# EAGLE design PolarTableShield (EAGLE 9.2.2)
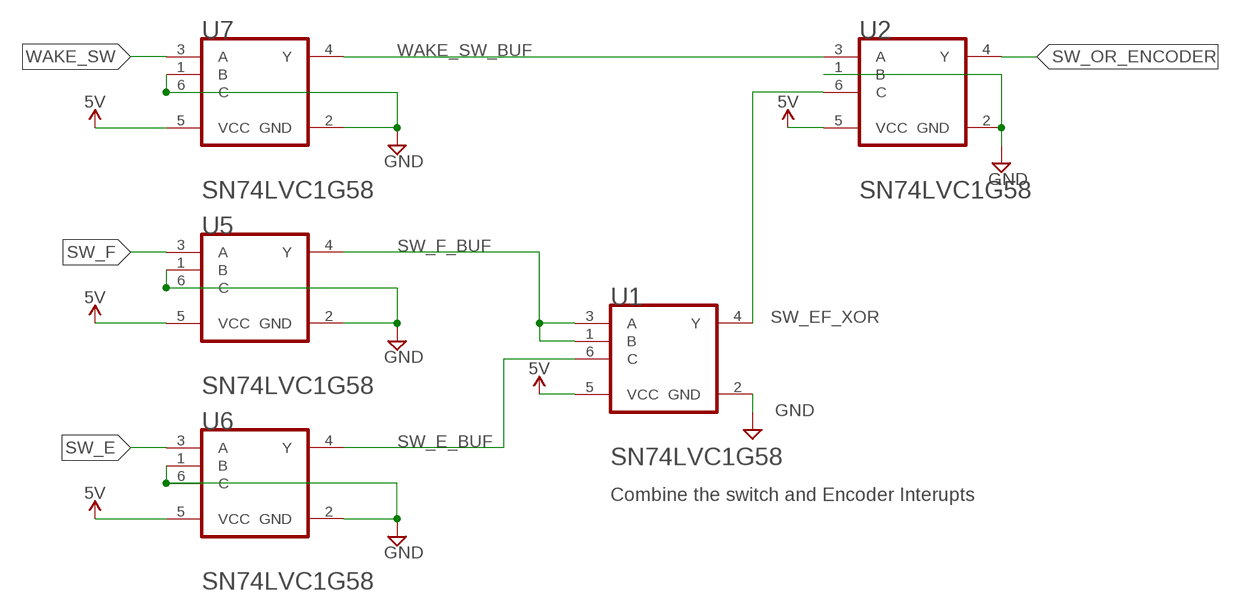
[diagram p0: schematic, sheet 1, part 1 of 2]
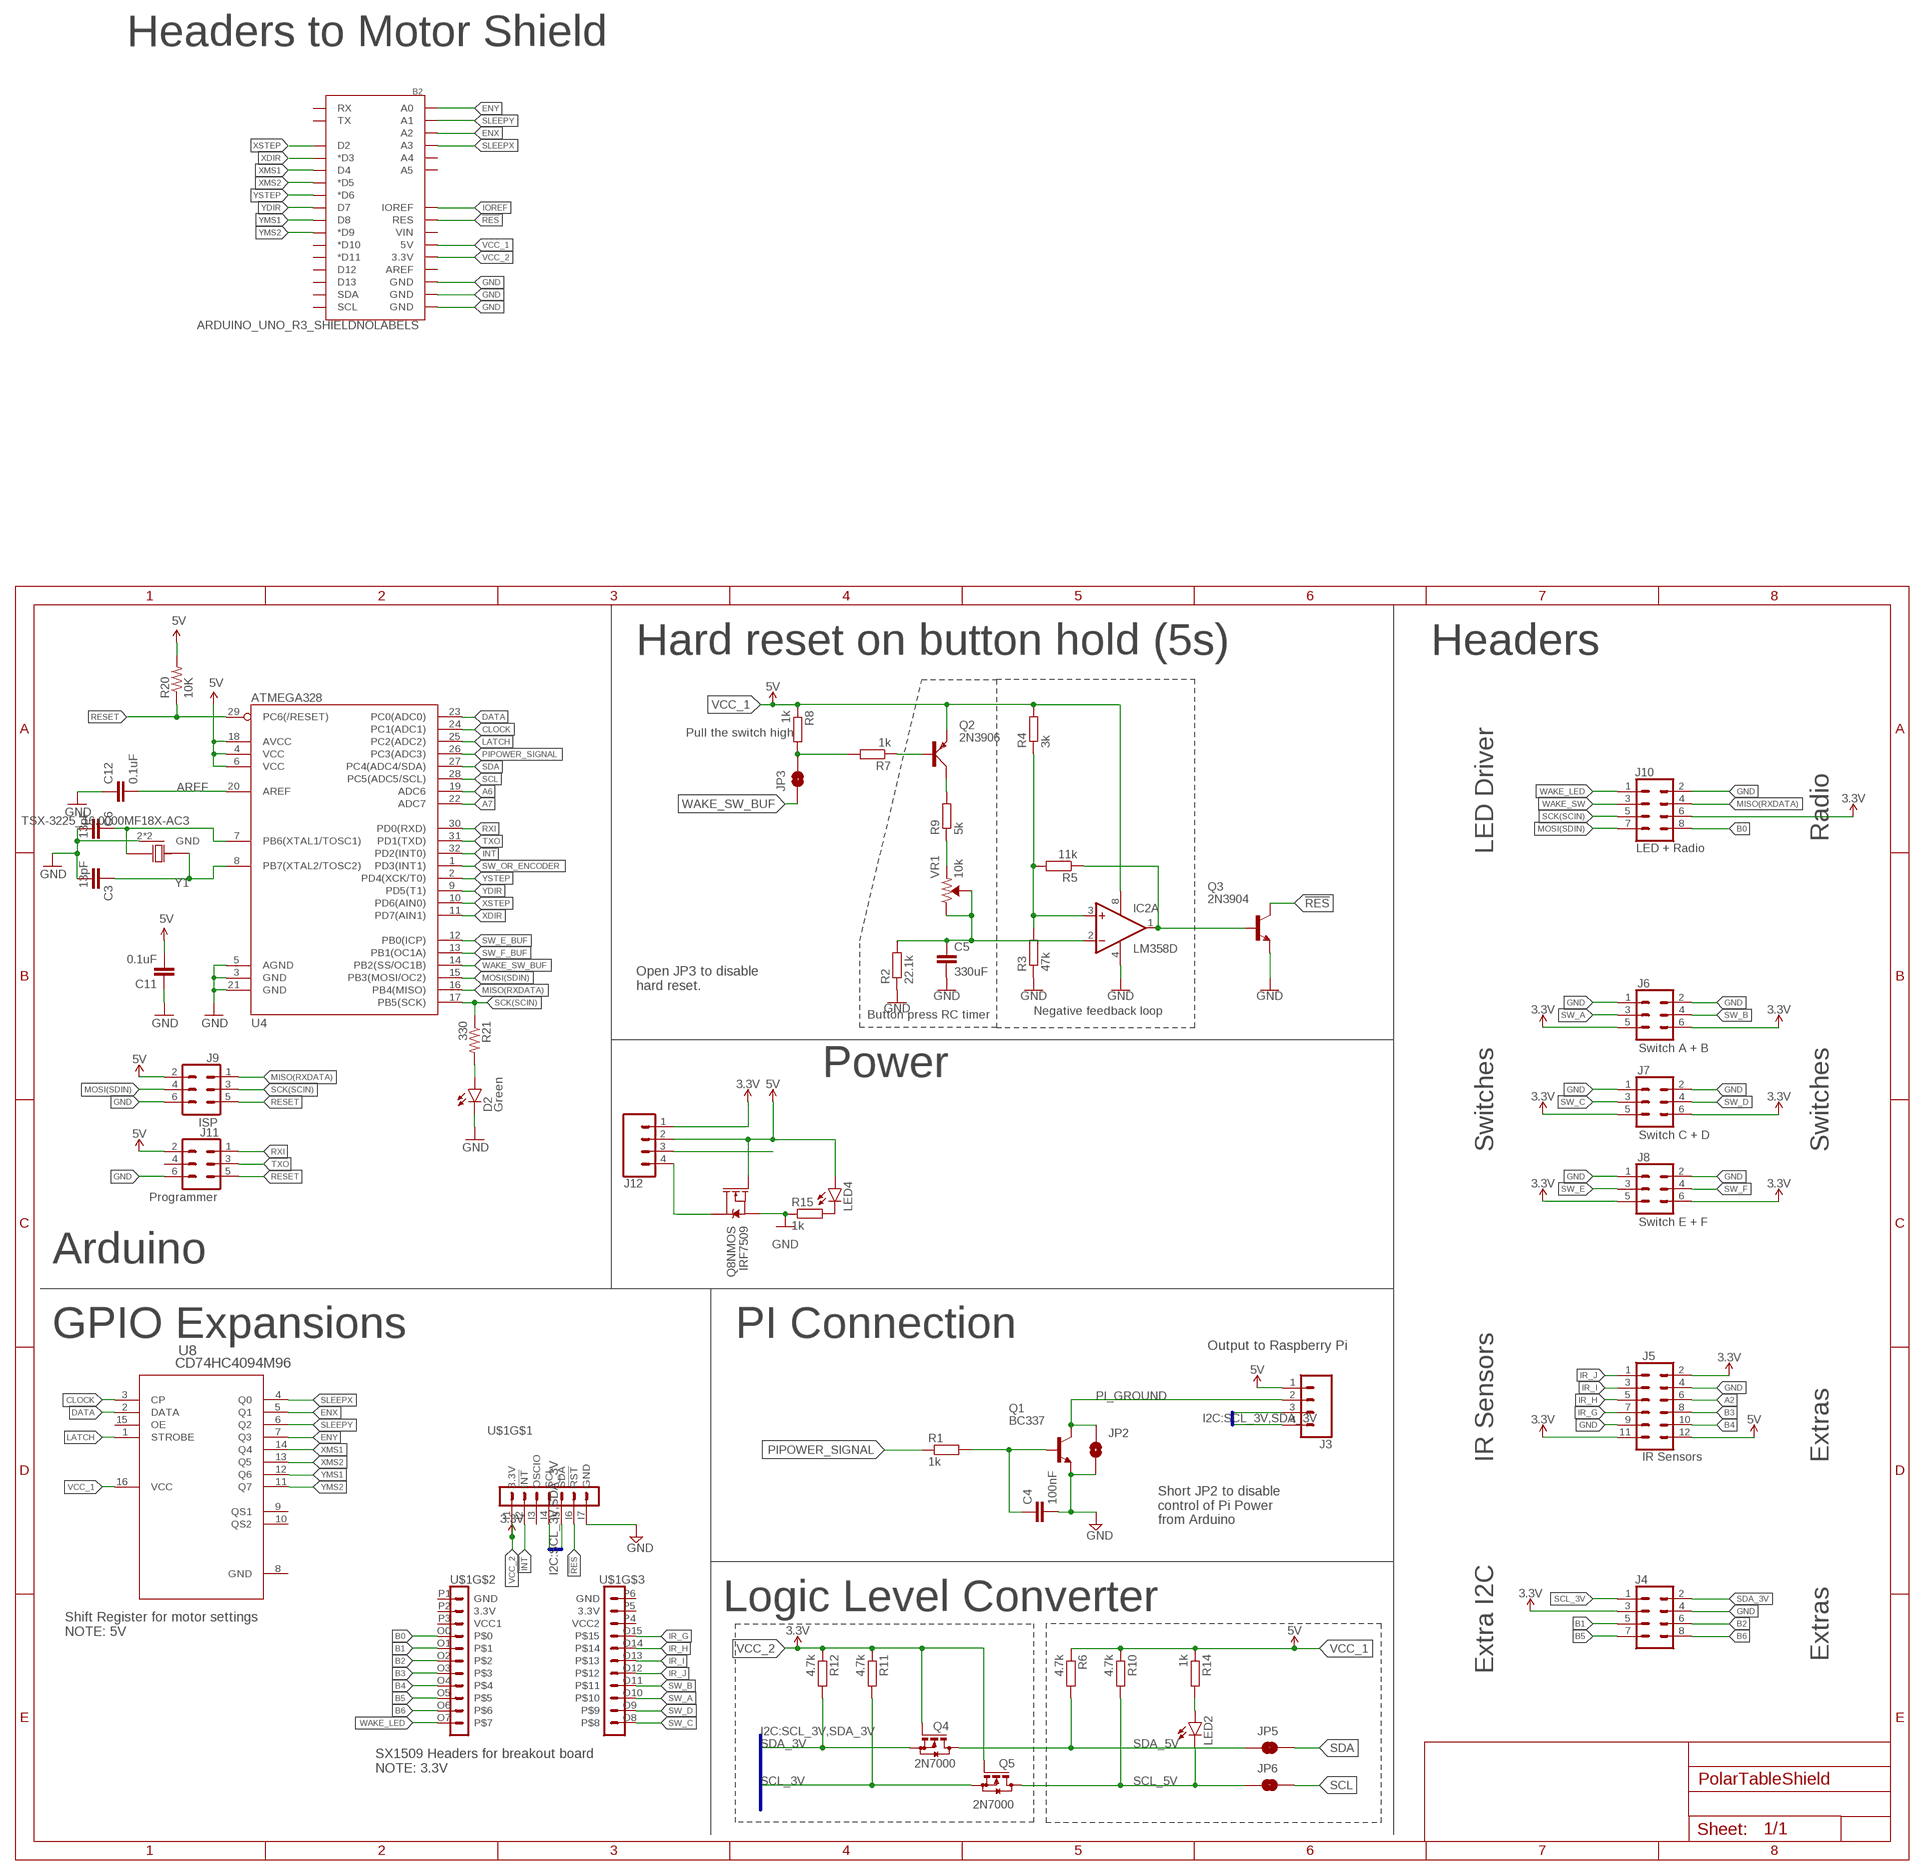
[diagram p1: schematic, sheet 1, part 2 of 2]

## Parts
B2  ARDUINO_UNO_R3_SHIELDNOLABELS  [UNO_R3_SHIELD_NOLABELS]
C3  13pF  CAP0603-CAP  [0603-CAP]
C4  100nF  C-EUC0805  [C0805]
C5  330uF  C-EUC0805  [C0805]
C6  13pF  CAP0603-CAP  [0603-CAP]
C11  0.1uF  CAP0603-CAP  [0603-CAP]
C12  0.1uF  CAP0603-CAP  [0603-CAP]
D2  Green  LEDCHIP-LED0805  [CHIP-LED0805]
IC2  LM358D  [SO08]
J3  Pi Connection  CONN_041X04_1.24MM_RA_MALE  [1X04_1.24MM_RA_MALE]
J4  CONN_04X22X4_1.24MM_RA_MALE  [2X4]
J5  IR Sensors  CONN_06X21.24MM_RA_MALE  [2X6]
J6  Switch A + B  CONN_03X22X03_2.54MM_RA_MALE  [2X3]
J7  Switch C + D  CONN_03X22X03_2.54MM_RA_MALE  [2X3]
J8  Switch E + F  CONN_03X22X03_2.54MM_RA_MALE  [2X3]
J9  ISP  CONN_03X2NO_SILK  [2X3-NS]
J10  LED + Radio  CONN_04X22X4_1.24MM_RA_MALE  [2X4]
J11  Programmer  CONN_03X2NO_SILK  [2X3-NS]
J12  CONN_04JST-PTH  [JST-4-PTH]
JP2  JUMPER-SMT_2_NO_SILK  [SMT-JUMPER_2_NO_SILK]
JP3  Enable Hold to Reset  JUMPER-SMT_2_NC_TRACE_SILK  [SMT-JUMPER_2_NC_TRACE_SILK]
JP5  JUMPER-SMT_2_NC_TRACE_NO-SILK  [SMT-JUMPER_2_NC_TRACE_NO-SILK]
JP6  JUMPER-SMT_2_NC_TRACE_NO-SILK  [SMT-JUMPER_2_NC_TRACE_NO-SILK]
LED2  LEDCHIP-LED0805  [CHIP-LED0805]
LED4  LEDCHIP-LED0805  [CHIP-LED0805]
Q1  BC337  [TO92]
Q2  2N3906  [TO92D]
Q3  2N3904  [TO92]
Q4  2N7000  [TO92-]
Q5  2N7000  [TO92-]
Q8  IRF7509  [MSOP8]
R1  1k  R-EU_M0805  [M0805]
R2  22.1k  R-EU_M0805  [M0805]
R3  47k  R-EU_M0805  [M0805]
R4  3k  R-EU_M0805  [M0805]
R5  11k  R-EU_M0805  [M0805]
R6  4.7k  R-EU_M0805  [M0805]
R7  1k  R-EU_M0805  [M0805]
R8  1k  R-EU_M0805  [M0805]
R9  5k  R-EU_M0805  [M0805]
R10  4.7k  R-EU_M0805  [M0805]
R11  4.7k  R-EU_M0805  [M0805]
R12  4.7k  R-EU_M0805  [M0805]
R14  1k  R-EU_M0805  [M0805]
R15  1k  R-EU_M0805  [M0805]
R20  10K  RESISTOR0603-RES  [0603-RES]
R21  330  RESISTOR0603-RES  [0603-RES]
U1  XOR  TEXAS_INSTRUMENTS_SN74LVC1G58SOT363  [SOT363_PHILIPS]
U2  OR  TEXAS_INSTRUMENTS_SN74LVC1G58SOT363  [SOT363_PHILIPS]
U4  ATMEGA328  ATMEGA168  [TQFP32-08]
U5  Buffer  TEXAS_INSTRUMENTS_SN74LVC1G58SOT363  [SOT363_PHILIPS]
U6  Buffer  TEXAS_INSTRUMENTS_SN74LVC1G58SOT363  [SOT363_PHILIPS]
U7  Buffer  TEXAS_INSTRUMENTS_SN74LVC1G58SOT363  [SOT363_PHILIPS]
U8  CD74HC4094M96  [D16]
U$1  SX1509  [SX1509]
VR1  10k  TRIMPOT-PTH-10MM-KNOB-1/2W-10%  [TRIMPOT-PTH-3386U]
Y1  TSX-3225_16.0000MF18X-AC3  [XTAL_TSX-3225_16.0000MF18X-AC3]

## Nets
12V_SUPPLY [12v_Supply]: J12.3
!INT [3v]: U4.32(PD2(INT0)) U$1.I2(!INT)
!RES [5v]: B2.RES Q3.1(C) U$1.I6(!RST)
$N99 [5v]: JP3.2 R7.2 R8.2
A2 [5v]: J5.6
A6 [5v]: U4.19(ADC6)
A7 [5v]: U4.22(ADC7)
AREF [5v]: C12.2 U4.20(AREF)
B0 [3v]: J10.8 U$1.O0
B1 [3v]: J4.5 U$1.O1
B2 [3v]: J4.6 U$1.O2
B3 [5v]: J5.8 U$1.O3
B4 [5v]: J5.10 U$1.O4
B5 [3v]: J4.7 U$1.O5
B6 [3v]: J4.8 U$1.O6
CLOCK [5v]: U4.24(PC1(ADC1)) U8.3(CP)
COMP_OUT [5v]: IC2.1(A:OUT) Q3.2(B) R5.1
DATA [5v]: U4.23(PC0(ADC0)) U8.2(DATA)
ENX [5v]: B2.A2 U8.5(Q1)
ENY [5v]: B2.A0 U8.7(Q3)
GND [5v]: B2.GND@0(GND) B2.GND@1(GND) B2.GND@2(GND) C3.2 C4.2 C5.2 C6.2 C11.1 C12.1 D2.C IC2.4(P:V-) J4.4 J5.4 J5.9 J6.1 J6.2 J7.1 J7.2 J8.1 J8.2 J9.6 J10.2 J11.6 JP2.2 Q1.1(E) Q3.3(E) Q8.1(NMOS:S) R2.1 R3.1 R15.1 U1.2(GND) U2.1(B) U2.2(GND) U4.3(GND) U4.5(AGND) U4.21(GND) U5.1(B) U5.2(GND) U5.6(C) U6.1(B) U6.2(GND) U6.6(C) U7.1(B) U7.2(GND) U7.6(C) U$1.I7(GND) Y1.2(GND) Y1.4(GND)
IOREF [5v]: B2.IOREF
IR_G [3v]: J5.7 U$1.O15
IR_H [3v]: J5.5 U$1.O14
IR_I [3v]: J5.3 U$1.O13
IR_J [3v]: J5.1 U$1.O12
LATCH [5v]: U4.25(PC2(ADC2)) U8.1(STROBE)
MISO(RXDATA) [5v]: J9.1 J10.4 U4.16(PB4(MISO))
MOSI(SDIN) [5v]: J9.4 J10.7 U4.15(PB3(MOSI/OC2))
N$1 [5v]: Q2.B R7.1
N$2 [5v]: C4.1 Q1.2(B) R1.2
N$3 [5v]: Q2.C R9.2
N$4: J12.4 Q8.7(NMOS:D) Q8.8(NMOS:D)
N$5 [5v]: IC2.3(A:+IN) R3.2 R4.1 R5.2
N$6 [5v]: R9.1 VR1.1(CCW)
N$7 [5v]: C3.1 U4.8(PB7(XTAL2/TOSC2)) Y1.1
N$8 [5v]: C5.1 IC2.2(A:-IN) R2.2 VR1.2(WIPER) VR1.3(CW)
N$9: LED4.C R15.2
N$10 [5v]: LED2.A R14.2
N$14 [5v]: D2.A R21.2
N$16 [5v]: C6.1 U4.7(PB6(XTAL1/TOSC1)) Y1.3
PI_GROUND [5v_Supply]: J3.2 JP2.1 Q1.3(C)
PIPOWER_SIGNAL [5v]: R1.1 U4.26(PC3(ADC3))
RESET [5v]: J9.5 J11.5 R20.1 U4.29(PC6(/RESET))
RXI [5v]: J11.1 U4.30(PD0(RXD))
SCK(SCIN) [5v]: J9.3 J10.5 R21.1 U4.17(PB5(SCK))
SCL [5v]: JP6.2 U4.28(PC5(ADC5/SCL))
SCL_3V [3v]: J3.3 J4.1 Q5.1(S) R11.2 U$1.I4(SCL)
SCL_5V [5v]: JP6.1 LED2.C Q5.3(D) R10.2
SDA [5v]: JP5.2 U4.27(PC4(ADC4/SDA))
SDA_3V [3v]: J3.4 J4.2 Q4.1(S) R12.2 U$1.I5(SDA)
SDA_5V [5v]: JP5.1 Q4.3(D) R6.2
SLEEPX [5v]: B2.A3 U8.4(Q0)
SLEEPY [5v]: B2.A1 U8.6(Q2)
SW_A [3v]: J6.3 U$1.O10
SW_B [3v]: J6.4 U$1.O11
SW_C [3v]: J7.3 U$1.O8
SW_D [3v]: J7.4 U$1.O9
SW_E [5v]: J8.3 U6.3(A)
SW_E_BUF [5v]: U1.6(C) U4.12(PB0(ICP)) U6.4(Y)
SW_EF_XOR [5v]: U1.4(Y) U2.6(C)
SW_F [5v]: J8.4 U5.3(A)
SW_F_BUF [5v]: U1.1(B) U1.3(A) U4.13(PB1(OC1A)) U5.4(Y)
SW_OR_ENCODER [5v]: U2.4(Y) U4.1(PD3(INT1))
TXO [5v]: J11.3 U4.31(PD1(TXD))
VCC_1 [5v]: B2.5V C11.2 IC2.8(P:V+) J3.1 J5.12 J9.2 J11.2 J12.2 LED4.A Q2.E Q8.2(NMOS:G) R4.2 R6.1 R8.1 R10.1 R14.1 R20.2 U1.5(VCC) U2.5(VCC) U4.4(VCC) U4.6(VCC) U4.18(AVCC) U5.5(VCC) U6.5(VCC) U7.5(VCC) U8.16(VCC) ; supply symbol labelled 5V
VCC_2 [3v]: B2.3.3V J4.3 J5.2 J5.11 J6.5 J6.6 J7.5 J7.6 J8.5 J8.6 J10.6 J12.1 Q4.2(G) Q5.2(G) R11.1 R12.1 U$1.I1(3.3V) ; supply symbol labelled 3.3V
WAKE_LED [3v]: J10.1 U$1.O7
WAKE_SW [5v]: J10.3 U7.3(A)
WAKE_SW_BUF [5v]: JP3.1 U2.3(A) U4.14(PB2(SS/OC1B)) U7.4(Y)
XDIR [5v]: B2.D3(*D3) U4.11(PD7(AIN1))
XMS1 [5v]: B2.D4 U8.14(Q4)
XMS2 [5v]: B2.D5(*D5) U8.13(Q5)
XSTEP [5v]: B2.D2 U4.10(PD6(AIN0))
YDIR [5v]: B2.D7 U4.9(PD5(T1))
YMS1 [5v]: B2.D8 U8.12(Q6)
YMS2 [5v]: B2.D9(*D9) U8.11(Q7)
YSTEP [5v]: B2.D6(*D6) U4.2(PD4(XCK/T0))
Unconnected: B2.A4 B2.A5 B2.AREF B2.D10(*D10) B2.D11(*D11) B2.D12 B2.D13 B2.RX B2.SCL B2.SDA B2.TX B2.VIN IC2.5(B:+IN) IC2.6(B:-IN) IC2.7(B:OUT) J11.4 Q8.3(PMOS:S) Q8.4(PMOS:G) Q8.5(PMOS:D) Q8.6(PMOS:D) U8.9(QS1) U8.10(QS2) U8.15(OE) U$1.I3(OSCIO) U$1.P1(GND) U$1.P2(3.3V) U$1.P3(VCC1) U$1.P4(VCC2) U$1.P5(3.3V) U$1.P6(GND)

## Buses
I2C:SCL_3V,SDA_3V

## Notes on the sheet
- Headers to Motor Shield
- Hard reset on button hold (5s) | Headers
- Radio
- LED Driver
- Open JP3 to disable
  hard reset.
- Negative feedback loop
- Button press RC timer
- Power
- Switches | Switches
- Arduino
- GPIO Expansions | PI Connection
- Output to Raspberry Pi
- IR Sensors | Extras
- Short JP2 to disable
  control of Pi Power
  from Arduino
- Logic Level Converter
- Shift Register for motor settings
  NOTE: 5V
- Extras
- Extra I2C
- Combine the switch and Encoder Interupts
- SX1509 Headers for breakout board
  NOTE: 3.3V

## Power pins joined to a net without a drawn wire
GND: U8.8(GND)

## Library data of the parts
B2 = keir_library:ARDUINO_UNO_R3_SHIELD: Arduino R3 Shield Footprint Shield form compatible with the Arduino Uno R3. SparkFun Products: MG2639 Cellular Shield <https://www.sparkfun.com/products/13120> MIDI Shield <https://www.sparkfun.com/products/12898> R3 Stackable Headers Kit <https://www.sparkfun.com/products/11417>
C3 C6 C11 C12 = SparkFun:CAP: Capacitor Standard 0603 ceramic capacitor, and 0.1" leaded capacitor.
C4 C5 = resistor:C-EU: CAPACITOR, European symbol
D2 LED2 LED4 = led:LED: LED OSRAM: - CHIPLED LG R971, LG N971, LY N971, LG Q971, LY Q971, LO R971, LY R971 LH N974, LH R974 LS Q976, LO Q976, LY Q976 LO Q996 - Hyper CHIPLED LW Q18S LB Q993, LB Q99A, LB R99A - SideLED LS A670, LO A670, LY A670, LG A670, LP A670 LB A673, LV A673, LT A673, LW A673 LH A674 LY A675 LS A676, LA A676, LO A676, LY A676, LW A676 LS A679, LY A679, LG A679 - Hyper Micro SIDELED® LS Y876, LA Y876, LO Y876, LY Y876 LT Y87S - SmartLED LW L88C, LW L88S LB L89C, LB L89S, LG L890 LS L89K, LO L89K, LY L89K LS L896, LA L896, LO L896, LY L896 - TOPLED LS T670, LO T670, LY T670, LG T670, LP T670 LSG T670, LSP T670, LSY T670, LOP T670, LYG T670 LG T671, LOG T671, LSG T671 LB T673, LV T673, LT T673, LW T673 LH T674 LS T676, LA T676, LO T676, LY T676, LB T676, LH T676, LSB T676, LW T676 LB T67C, LV T67C, LT T67C, LS T67K, LO T67K, LY T67K, LW E67C LS E67B, LA E67B, LO E67B, LY E67B, LB E67C, LV E67C, LT E67C LW T67C LS T679, LY T679, LG T679 LS T770, LO T770, LY T770, LG T770, LP T770 LB T773, LV T773, LT T773, LW T773 LH T774 LS E675, LA E675, LY E675, LS T675 LS T776, LA T776, LO T776, LY T776, LB T776 LHGB T686 LT T68C, LB T68C - Hyper Mini TOPLED® LB M676 - Mini TOPLED Santana® LG M470 LS M47K, LO M47K, LY M47K Source: http://www.osram.convergy.de LUXEON: - LUMILED® LXK2-PW12-R00, LXK2-PW12-S00, LXK2-PW14-U00, LXK2-PW14-V00 LXK2-PM12-R00, LXK2-PM12-S00, LXK2-PM14-U00 LXK2-PE12-Q00, LXK2-PE12-R00, LXK2-PE12-S00, LXK2-PE14-T00, LXK2-PE14-U00 LXK2-PB12-K00, LXK2-PB12-L00, LXK2-PB12-M00, LXK2-PB14-N00, LXK2-PB14-P00, LXK2-PB14-Q00 LXK2-PR12-L00, LXK2-PR12-M00, LXK2-PR14-Q00, LXK2-PR14-R00 LXK2-PD12-Q00, LXK2-PD12-R00, LXK2-PD12-S00 LXK2-PH12-R00, LXK2-PH12-S00 LXK2-PL12-P00, LXK2-PL12-Q00, LXK2-PL12-R00 Source: www.luxeon.com KINGBRIGHT: KA-3528ASYC Source: www.kingbright.com
IC2 = keir_library:LM358: OP AMP also LM158; LM258; LM2904 Source: http://cache.national.com/ds/LM/LM158.pdf
J3 = keir_library:CONN_04: Multi connection point. Often used as Generic Header-pin footprint for 0.1 inch spaced/style header connections On any of the 0.1 inch spaced packages, you can populate with these: Break Away Headers - Straight <https://www.sparkfun.com/products/116> (PRT-00116) Break Away Male Headers - Right Angle <https://www.sparkfun.com/products/553> (PRT-00553) Female Headers <https://www.sparkfun.com/products/115> (PRT-00115) Break Away Headers - Machine Pin <https://www.sparkfun.com/products/117> (PRT-00117) Break Away Female Headers - Swiss Machine Pin <https://www.sparkfun.com/products/743> (PRT-00743) For SCREWTERMINALS and SPRING TERMINALS visit here: Screw Terimnals on SparkFun.com <https://www.sparkfun.com/search/results?term=Screw+Terminals> (5mm/3.5mm/2.54mm spacing) This device is also useful as a general connection point to wire up your design to another part of your project. Our various solder wires solder well into these plated through hole pads. Hook-Up Wire - Assortment (Stranded, 22 AWG) <https://www.sparkfun.com/products/11375> (PRT-11375) Hook-Up Wire - Assortment (Solid Core, 22 AWG) <https://www.sparkfun.com/products/11367> (PRT-11367) View the entire wire category on our website here <https://www.sparkfun.com/categories/141> Special notes: Molex polarized connector foot print use with SKU : PRT-08231 with associated crimp pins and housings. 1MM SMD Version SKU: PRT-10208
J4 J10 = keir_library:CONN_04X2: Multi connection point. Often used as Generic Header-pin footprint for 0.1 inch spaced/style header connections On any of the 0.1 inch spaced packages, you can populate with these: Break Away Headers - Straight <https://www.sparkfun.com/products/116> (PRT-00116) Break Away Male Headers - Right Angle <https://www.sparkfun.com/products/553> (PRT-00553) Female Headers <https://www.sparkfun.com/products/115> (PRT-00115) Break Away Headers - Machine Pin <https://www.sparkfun.com/products/117> (PRT-00117) Break Away Female Headers - Swiss Machine Pin <https://www.sparkfun.com/products/743> (PRT-00743)
J5 = keir_library:CONN_06X2: Multi connection point. Often used as Generic Header-pin footprint for 0.1 inch spaced/style header connections On any of the 0.1 inch spaced packages, you can populate with these: Break Away Headers - Straight <https://www.sparkfun.com/products/116> (PRT-00116) Break Away Male Headers - Right Angle <https://www.sparkfun.com/products/553> (PRT-00553) Female Headers <https://www.sparkfun.com/products/115> (PRT-00115) Break Away Headers - Machine Pin <https://www.sparkfun.com/products/117> (PRT-00117) Break Away Female Headers - Swiss Machine Pin <https://www.sparkfun.com/products/743> (PRT-00743)
J6-J9 J11 = keir_library:CONN_03X2: Multi connection point. Often used as Generic Header-pin footprint for 0.1 inch spaced/style header connections You can populate with any combo of single row headers, but if you'd like an exact match, check these: Header - 2x3 (Male, 0.1") <https://www.sparkfun.com/products/12807> (PRT-12807) Header - 2x3 (Female, 0.1") <https://www.sparkfun.com/products/13010> (PRT-13010) 2x3 Pin Shrouded Header <https://www.sparkfun.com/products/10877> (PRT-10877) On any of the 0.1 inch spaced packages, you can populate with these: Break Away Headers - Straight <https://www.sparkfun.com/products/116> (PRT-00116) Break Away Male Headers - Right Angle <https://www.sparkfun.com/products/553> (PRT-00553) Female Headers <https://www.sparkfun.com/products/115> (PRT-00115) Break Away Headers - Machine Pin <https://www.sparkfun.com/products/117> (PRT-00117) Break Away Female Headers - Swiss Machine Pin <https://www.sparkfun.com/products/743> (PRT-00743) Special note: the shrouded connector mates well with our 3x2 ribbon cables: Ribbon Crimp Connector - 6-pin (2x3, Female) <https://www.sparkfun.com/products/10651> (PRT-10651) Ribbon Cable - 6 wire (15ft) <https://www.sparkfun.com/products/10646> (PRT-10646)
J12 = SparkFun-Connectors:CONN_04: Multi connection point. Often used as Generic Header-pin footprint for 0.1 inch spaced/style header connections On any of the 0.1 inch spaced packages, you can populate with these: Break Away Headers - Straight <https://www.sparkfun.com/products/116> (PRT-00116) Break Away Male Headers - Right Angle <https://www.sparkfun.com/products/553> (PRT-00553) Female Headers <https://www.sparkfun.com/products/115> (PRT-00115) Break Away Headers - Machine Pin <https://www.sparkfun.com/products/117> (PRT-00117) Break Away Female Headers - Swiss Machine Pin <https://www.sparkfun.com/products/743> (PRT-00743) For SCREWTERMINALS and SPRING TERMINALS visit here: Screw Terimnals on SparkFun.com <https://www.sparkfun.com/search/results?term=Screw+Terminals> (5mm/3.5mm/2.54mm spacing) This device is also useful as a general connection point to wire up your design to another part of your project. Our various solder wires solder well into these plated through hole pads. Hook-Up Wire - Assortment (Stranded, 22 AWG) <https://www.sparkfun.com/products/11375> (PRT-11375) Hook-Up Wire - Assortment (Solid Core, 22 AWG) <https://www.sparkfun.com/products/11367> (PRT-11367) View the entire wire category on our website here <https://www.sparkfun.com/categories/141> Special notes: Molex polarized connector foot print use with SKU : PRT-08231 with associated crimp pins and housings. 1MM SMD Version SKU: PRT-10208; PROD_ID: WIRE-13531; SF_ID: PRT-09916
JP2 = SparkFun-Jumpers:JUMPER-SMT_2_NO: Normally open jumper This jumper has two pads in close proximity to each other. Apply solder to close the connection. Round pads are easier to solder for beginners, but are a lot larger. SparkFun Product that uses the round pads: SparkFun EL Sequencer <https://www.sparkfun.com/products/12781>
JP3 JP5 JP6 = SparkFun-Jumpers:JUMPER-SMT_2_NC_TRACE: Normally closed trace jumper This jumper has a trace between two pads so it's normally closed (NC). Use a razor knife to open the connection. For best results follow the IPC guidelines for cutting traces: Cutout at least 0.063 mm (0.005 in). Remove all loose material to clean up the cut area. Seal the cut with an approved epoxy. Reapply solder to reclose the connection.
Q1 = transistor-npn:BC337*: NPN Transistor
Q2 = transistor-small-signal:2N3906: PNP TRANSISTOR
Q3 = transistor-npn:2N3904: NPN Transistor; NOTE: Pull high until we get comparitor high output
Q4 Q5 = keir_library:2N7000: N-CHANNEL MOS FET
Q8 = SparkFun-DiscreteSemi:IRF7509: Dual N and P Channel MOSFET Dual N/P-Channel 30V 1.25 W 7.8/7.5 nC Hexfet Power Mosfet Surface Mount-MICRO-8. NMOS RDS(ON) 0.11Ω. PMOS RDS(ON) 0.20Ω. Link to datasheet <http://www.irf.com/product-info/datasheets/data/irf7509pbf.pdf> SparkFun Products: SparkFun RedBot Mainboard <https://www.sparkfun.com/products/12097> SparkFun Wake on Shake <https://www.sparkfun.com/products/11447>; PROD_ID: TRANS-07913
R1-R7 R9-R12 R14 R15 = rcl:R-EU_: RESISTOR, European symbol; SPICEPREFIX: R
R8 = rcl:R-EU_: RESISTOR, European symbol; NOTE: Pull the switch high; SPICEPREFIX: R
R20 R21 = SparkFun:RESISTOR: Resistor Basic schematic elements and footprints for 0603, 1206, and PTH resistors.
U1 U2 U5-U7 = Texas Instruments - SN74LVC1G58:TEXAS_INSTRUMENTS_SN74LVC1G58: 74LVC1G58 Low-power configurable multiple function gate Data sheet <https://assets.nexperia.com/documents/data-sheet/74LVC1G58.pdf>
U4 = SparkFun:ATMEGA168
U8 = keir_library:CD74HC4094M96; MANUFACTURER_PART_NUMBER: CD74HC4094M96; VENDOR: Texas Instruments
U$1 = keir_library:SX1509
VR1 = SparkFun-Resistors:TRIMPOT: Trimming Potentiometer (Trimpot) Three-terminal potentiometers, with an adjustable wiper and two adjustable resistors. A pot can be used to create a configurable voltage divider, or as a variable resistor. "Trimpots" are a subset of potentiometers, usually intended for "set-and-forget" applications. They're often more delicate than standard potentiometers - rated for fewer turns. Variants PTH-KNOB - PTH Trimpot w/ finger-adjustable knob Trimpot 10K with Knob <https://www.sparkfun.com/products/9806> (COM-09806) Datasheet <http://www.sparkfun.com/datasheets/Components/General/TSR-3386.pdf> SMD-3MM-CLOSED-FRAME - SMD 3mm Square Closed-Frame Trimpot Used on e.g. EasyDriver - Stepper Motor Driver <https://www.sparkfun.com/products/12779> Datasheet <http://www.bitechnologies.com/pdfs/22.pdf> (22AR10KTR) SMD-5MM - SMD 5mm Square Closed-Frame Trimpot Used on e.g. IOIO-OTG - V2.2 <https://www.sparkfun.com/products/13613> Datasheet <http://www.vishay.com/docs/51008/ts53.pdf> (TS53YL502MR10) SMD-3MM-1/10W-25% - 3mm Square Open-Frame Trimpot Used on e.g. SparkFun Shapeoko <https://www.sparkfun.com/products/13899> Datasheet <http://www.bourns.com/docs/Product-Datasheets/TC33.pdf> (TC33X-2-103E); PROD_ID: RES-09730; SF_SKU: COM-09806
Y1 = keir_library:TSX-3225_16.0000MF18X-AC3: SMD Crystal 16MHz-9pF-10ppm-60R;; AVAILABILITY: Unavailable; DESCRIPTION: SMD Crystal 16MHz-9pF-10ppm-60R;; MF: EPSON; MP: TSX-3225 16.0000MF18X-AC3; PACKAGE: SMD-4 Epson; PRICE: None

## Net classes
1 12v_Supply: width 1.2 mm, clearance 0.31 mm
2 5v_Supply: width 1 mm

## Board
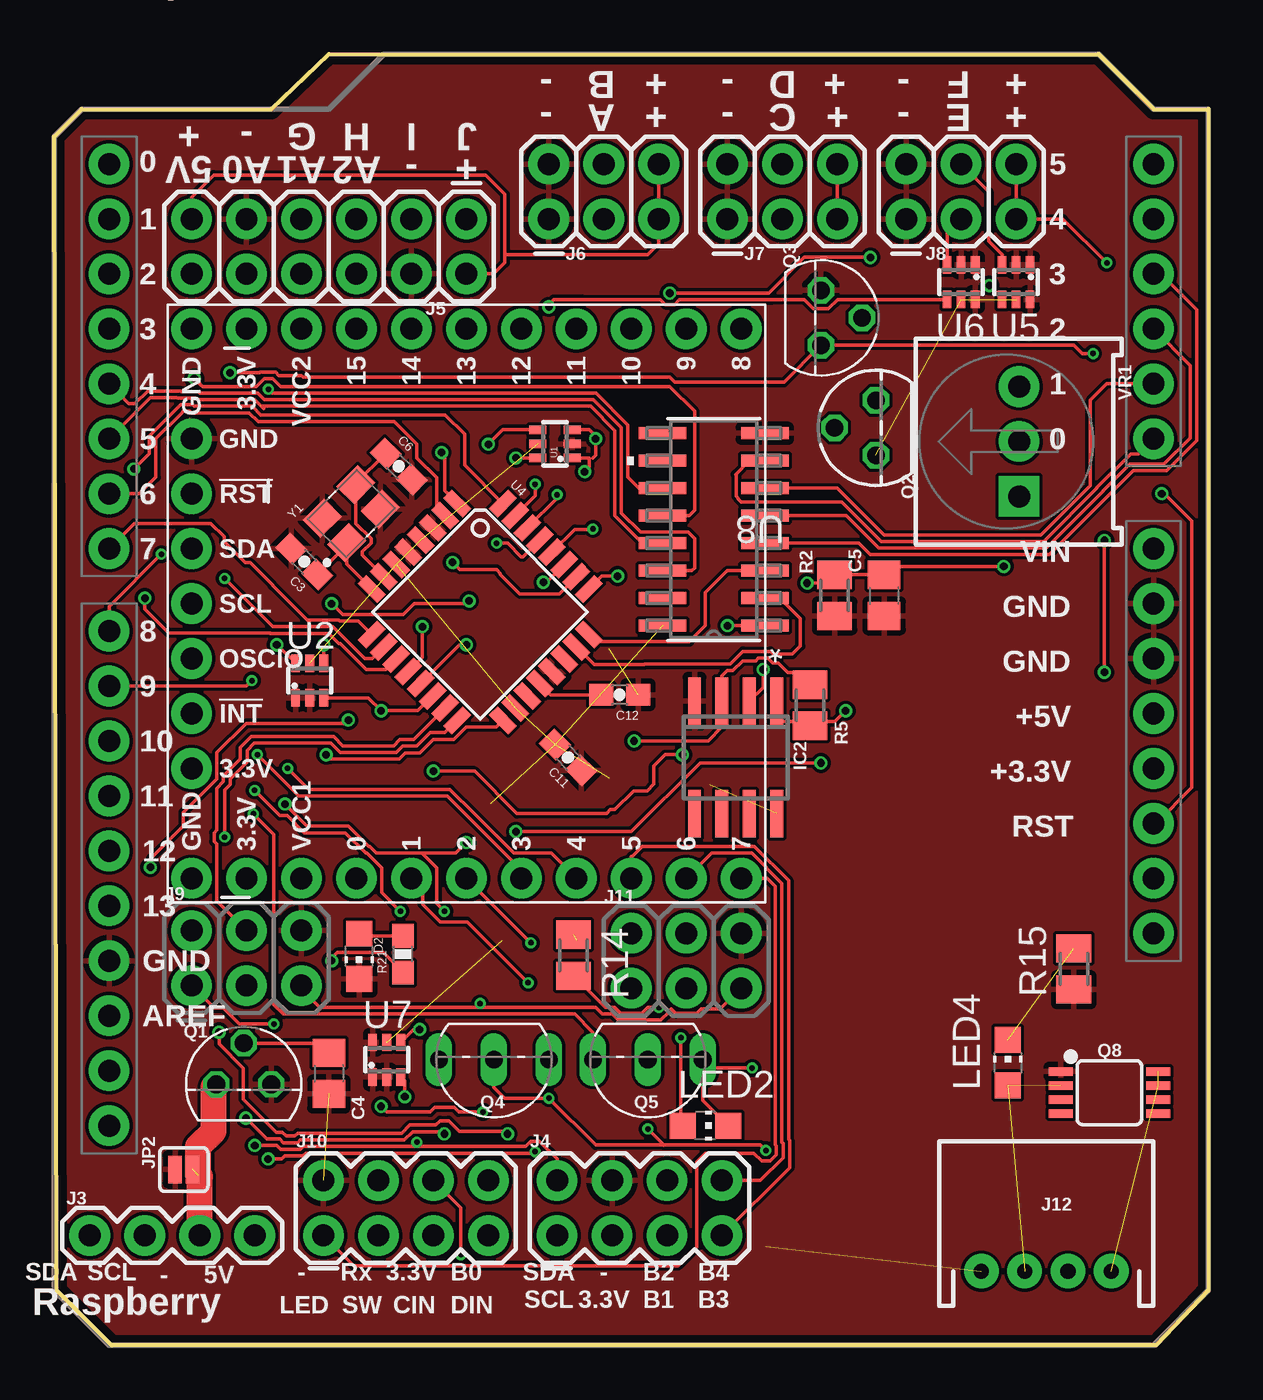
[diagram p2: board, top side]
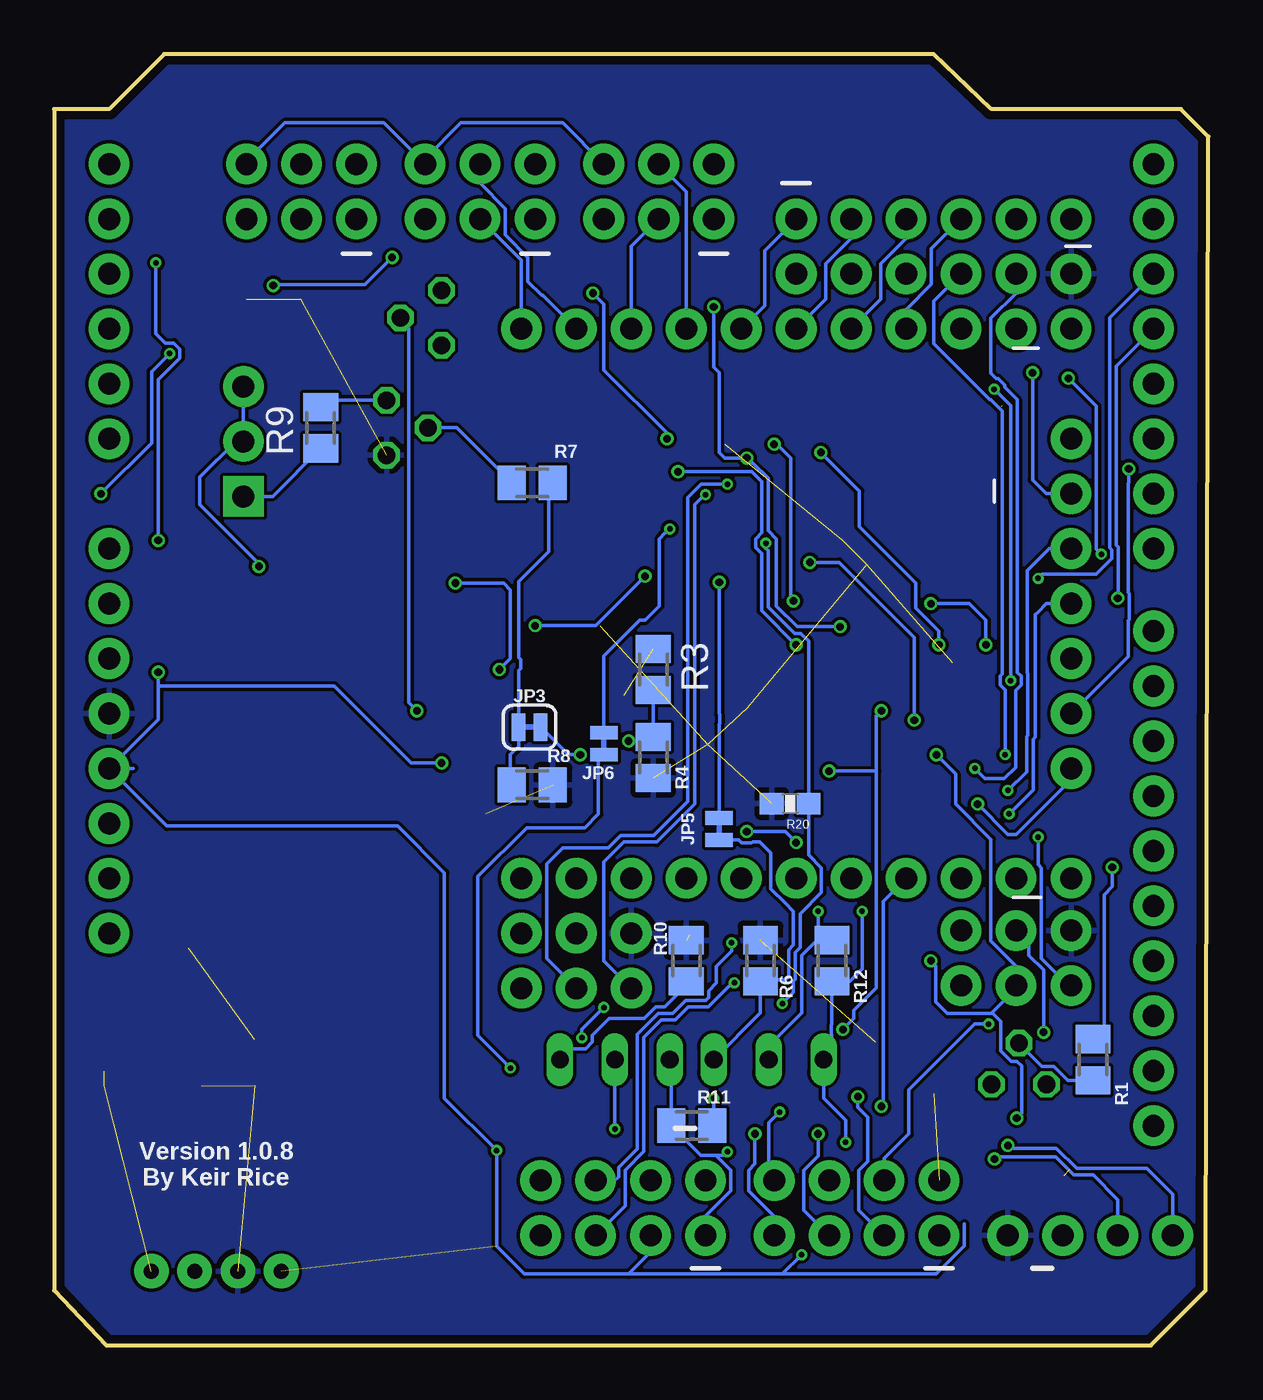
[diagram p3: board, bottom side, seen from below]

Size 53.34 x 59.69 mm. Coordinates in mm from the lower left corner, seen from the top.
Outline: 0.13,2.54 0,55.88 1.27,57.15 10.03,57.15 12.7,59.69 48.26,59.69 50.8,57.15 53.34,57.15 53.34,2.54 50.93,0 2.67,0 0.13,2.54
Copper layers (1*16): Top 0.035559375mm / dielectric 1.6mm / Bottom 0.035559375mm
Design rules "oshpark-2layer": minimum track width 6mil, minimum drill 10mil, track to track 6mil, track to pad 6mil, pad to pad 6mil, via to via 6mil, smd to smd 6mil, copper to edge 15mil, drill to drill 6mil, minimum pad ring 5mil, minimum via ring 5mil, stop-mask expansion 2.5mil, vias tented up to drill 0mil, thermal gap 10mil

### Footprints (pad centres in the part's own frame; a part is rotated, then mirrored left to right if it is on the bottom)
UNO_R3_SHIELD_NOLABELS = drill 1.016 pad 1.88: 3.3V 24.13,-3.81; 5V 24.13,-1.27; A0 24.13,11.43; A1 24.13,13.97; A2 24.13,16.51; A3 24.13,19.05; A4 24.13,21.59; A5 24.13,24.13; AREF -24.13,-15.24; D2 -24.13,19.05; D3 -24.13,16.51; D4 -24.13,13.97; D5 -24.13,11.43; D6 -24.13,8.89; D7 -24.13,6.35; D8 -24.13,2.54; D9 -24.13,0; D10 -24.13,-2.54; D11 -24.13,-5.08; D12 -24.13,-7.62; D13 -24.13,-10.16; GND@0 24.13,1.27; GND@1 24.13,3.81; GND@2 -24.13,-12.7; IOREF 24.13,-8.89; NC 24.13,-11.43; RES 24.13,-6.35; RX -24.13,24.13; SCL -24.13,-20.32; SDA -24.13,-17.78; TX -24.13,21.59; VIN 24.13,6.35
0603-CAP = smd 1.1 x 1: 1 -0.85,0; 2 0.85,0
C0805 = smd 1.3 x 1.5: 1 -0.95,0; 2 0.95,0
CHIP-LED0805 = smd 1.2 x 1.2: A 0,-1.05; C 0,1.05
SO08 = smd 0.6 x 2.2: 1 -1.905,-2.6; 2 -0.635,-2.6; 3 0.635,-2.6; 4 1.905,-2.6; 5 1.905,2.6; 6 0.635,2.6; 7 -0.635,2.6; 8 -1.905,2.6
1X04_1.24MM_RA_MALE = drill 1.016 pad 1.88: 1 0,0; 2 2.54,0; 3 5.08,0; 4 7.62,0
2X4 = drill 1.016 pad 1.88: 1 -3.81,-1.27; 2 -3.81,1.27; 3 -1.27,-1.27; 4 -1.27,1.27; 5 1.27,-1.27; 6 1.27,1.27; 7 3.81,-1.27; 8 3.81,1.27
2X6 = drill 1.016 pad 1.88: 1 0,0; 2 0,2.54; 3 2.54,0; 4 2.54,2.54; 5 5.08,0; 6 5.08,2.54; 7 7.62,0; 8 7.62,2.54; 9 10.16,0; 10 10.16,2.54; 11 12.7,0; 12 12.7,2.54
2X3 = drill 1.016 pad 1.88: 1 0,0; 2 0,2.54; 3 2.54,0; 4 2.54,2.54; 5 5.08,0; 6 5.08,2.54
2X3-NS = drill 1.016 pad 1.88: 1 -2.54,-1.27; 2 -2.54,1.27; 3 0,-1.27; 4 0,1.27; 5 2.54,-1.27; 6 2.54,1.27
JST-4-PTH = drill 0.7 pad 1.6: 1 -3,0; 2 -1,0; 3 1,0; 4 3,0
SMT-JUMPER_2_NO_SILK = smd 0.635 x 1.27: 1 -0.406,0; 2 0.406,0
SMT-JUMPER_2_NC_TRACE_SILK = smd 0.635 x 1.27: 1 -0.508,0; 2 0.508,0
SMT-JUMPER_2_NC_TRACE_NO-SILK = smd 0.635 x 1.27: 1 -0.508,0; 2 0.508,0
TO92 = drill 0.813 octagon: 1 1.27,0; 2 0,1.905; 3 -1.27,0
TO92D = drill 0.813 octagon: B 0,1.905; C 1.27,0; E -1.27,0
TO92- = drill 0.813 long: 1 2.54,0; 2 0,0; 3 -2.54,0
MSOP8 = smd 0.4 x 1.1: 1 -0.975,-2.25; 2 -0.325,-2.25; 3 0.325,-2.25; 4 0.975,-2.25; 5 0.975,2.25; 6 0.325,2.25; 7 -0.325,2.25; 8 -0.975,2.25
M0805 = smd 1.3 x 1.6: 1 -0.95,0; 2 0.95,0
0603-RES = smd 1.1 x 1: 1 -0.85,0; 2 0.85,0
SOT363_PHILIPS = smd 0.4 x 0.8: 1 -0.65,-0.8; 2 0,-0.8; 3 0.65,-0.8; 4 0.65,0.8; 5 0,0.8; 6 -0.65,0.8
TQFP32-08 = smd 1.27 x 0.559: 1 -4.293,2.8; 2 -4.293,2; 3 -4.293,1.2; 4 -4.293,0.4; 5 -4.293,-0.4; 6 -4.293,-1.2; 7 -4.293,-2; 8 -4.293,-2.8; 17 4.293,-2.8; 18 4.293,-2; 19 4.293,-1.2; 20 4.293,-0.4; 21 4.293,0.4; 22 4.293,1.2; 23 4.293,2; 24 4.293,2.8 | smd 0.559 x 1.27: 9 -2.8,-4.293; 10 -2,-4.293; 11 -1.2,-4.293; 12 -0.4,-4.293; 13 0.4,-4.293; 14 1.2,-4.293; 15 2,-4.293; 16 2.8,-4.293; 25 2.8,4.293; 26 2,4.293; 27 1.2,4.293; 28 0.4,4.293; 29 -0.4,4.293; 30 -1.2,4.293; 31 -2,4.293; 32 -2.8,4.293
D16 = smd 2.184 x 0.559: 1 -2.362,4.445; 2 -2.362,3.175; 3 -2.362,1.905; 4 -2.362,0.635; 5 -2.362,-0.635; 6 -2.362,-1.905; 7 -2.362,-3.175; 8 -2.362,-4.445; 9 2.362,-4.445; 10 2.362,-3.175; 11 2.362,-1.905; 12 2.362,-0.635; 13 2.362,0.635; 14 2.362,1.905; 15 2.362,3.175; 16 2.362,4.445
SX1509 = drill 1.016 pad 1.88: I1 -7.62,12.7; I2 -5.08,12.7; I3 -2.54,12.7; I4 0,12.7; I5 2.54,12.7; I6 5.08,12.7; I7 7.62,12.7; O0 -12.7,5.08; O1 -12.7,2.54; O2 -12.7,0; O3 -12.7,-2.54; O4 -12.7,-5.08; O5 -12.7,-7.62; O6 -12.7,-10.16; O7 -12.7,-12.7; O8 12.7,-12.7; O9 12.7,-10.16; O10 12.7,-7.62; O11 12.7,-5.08; O12 12.7,-2.54; O13 12.7,0; O14 12.7,2.54; O15 12.7,5.08; P1 -12.7,12.7; P2 -12.7,10.16; P3 -12.7,7.62; P4 12.7,7.62; P5 12.7,10.16; P6 12.7,12.7
TRIMPOT-PTH-3386U = drill 1.016 pad 1.88 square: 1 -2.54,-0.015 | drill 1.016 pad 1.88: 2 0,-0.015; 3 2.54,-0.015
XTAL_TSX-3225_16.0000MF18X-AC3 = smd 1.4 x 1.15: 1 -1.1,-0.8; 2 1.1,-0.8; 3 1.1,0.8; 4 -1.1,0.8

### Placement (x,y rotation side)
B2  26.67,30.48 0 top
C3  11.56,36.23 135 top
C4  12.7,12.57 270 top
C5  38.35,34.67 270 top
C6  15.93,40.63 315 top
C11  23.75,27.18 135 top
C12  26.14,30.07 180 top
D2  14.1,17.98 180 top
IC2  31.5,27.18 180 top
J3  9.27,5.08 180 top
J4  27.05,6.35 0 top
J5  19.05,52.07 180 top
J6  22.86,52.07 0 top
J7  31.11,52.07 0 top
J8  39.37,52.07 0 top
J9  8.89,17.91 0 top
J10  16.26,6.35 0 top
J11  29.21,17.78 0 top
J12  45.85,3.43 0 top
JP2  5.99,8.13 180 top
JP3  31.37,28.57 180 bottom
JP5  22.61,23.88 90 bottom
JP6  27.94,27.81 90 bottom
LED2  30.1,10.16 270 top
LED4  44.07,13.08 0 top
Q1  8.76,12.06 0 top
Q2  37.97,42.42 90 top
Q3  35.43,47.5 270 top
Q4  20.32,13.21 180 top
Q5  27.43,13.21 180 top
Q8  48.77,11.68 270 top
R1  5.33,13.21 270 bottom
R2  36.07,34.67 90 top
R3  25.65,31.24 270 bottom
R4  25.65,27.18 270 bottom
R5  34.92,29.59 90 top
R6  20.7,17.78 270 bottom
R7  31.24,39.88 0 bottom
R8  31.24,25.91 180 bottom
R9  41.02,42.42 90 bottom
R10  24.13,17.78 270 bottom
R11  23.88,10.16 180 bottom
R12  17.4,17.78 270 bottom
R14  24,18.03 270 top
R15  47.12,17.4 90 top
R20  19.33,25.04 180 bottom
R21  16.13,18.08 90 top
U1  23.14,41.67 90 top
U2  11.81,30.73 0 top
U4  19.68,33.91 315 top
U5  44.45,49.15 180 top
U6  41.91,49.15 180 top
U7  15.37,13.21 0 top
U8  30.48,37.72 180 top
U$1  19.05,34.29 90 top
U$3  [TRI_LOGO_BOTTOM_5MM]  97.28,38.1 0 top  (outside the outline)
VR1  44.58,41.78 90 top
Y1  13.74,38.45 45 top

### Tracks (layer width: path | path; a pad name or v marks a point on that pad's centre or on a via)
!INT  (via drill 0.35)
  Top 0.152: U4.32 18.97,40.69 18.97,42.11 18.08,43 9.55,43 9.15,43.41 6.48,43.41 6.4,43.48 5.84,43.48 4.39,42.04 4.39,41.22 v3.68,40.51
  Bottom 0.152: v3.68,40.51 3.68,39.88 3.71,39.85 3.71,34.81 3.66,34.76 3.66,33.55 3.71,33.5 3.71,31.85 U$1.I2
!RES  (via drill 0.25, 0.35)
  Top 0.152: v48.01,45.85 47.5,45.85 47.12,46.23 Q3.1 33.73,44.53 28.68,44.53 28.45,44.76 11.51,44.76 11.43,44.83 10.38,44.83 10.23,44.98 9.53,44.98 9.5,44.96 v8.13,44.96 | B2.RES 50.93,24.13 52.58,25.78 52.58,38.1 51.31,39.37 v51.18,39.37
  Bottom 0.152: U$1.I6 7.49,39.37 8.13,40.01 v8.13,44.96 | v48.01,45.85 48.83,45.02 48.83,41.72 v51.18,39.37
$N99
  Bottom 0.152: R7.2 30.48,39.69 30.48,36.7 31.88,35.31 31.88,31.8 31.77,31.7 31.77,31.3 31.88,31.2 JP3.2 31.88,27.69 32.26,27.3 32.26,25.97 R8.2
AREF
  Top 0.152: C12.2 22.95,30.07 U4.20
B0  (via drill 0.25, 0.35)
  Top 0.152: v19.81,10.79 18.69,10.79 18.49,11 17.58,11 17.38,10.79 15.37,10.79 v15.11,11.05
  Bottom 0.152: J10.8 20.32,7.87 20.32,10.29 v19.81,10.79 | U$1.O0 15.04,20.52 15.04,15.02 15.03,15.01 15.03,11.13 v15.11,11.05
B1  (via drill 0.25)
  Top 0.152: U$1.O1 17.03,21.07 17.03,20.39 17.83,19.58 19.09,19.58 v21.91,16.76
  Bottom 0.152: J4.5 26.95,6.45 26.95,8.1 26.09,8.97 26.09,14.24 25.29,15.04 24.64,15.04 24.03,15.65 23.11,15.65 22.25,16.5 22.25,16.51 22,16.76 v21.91,16.76
B2  (via drill 0.25)
  Top 0.152: U$1.O2 v22.04,18.61
  Bottom 0.152: v22.04,18.61 22.04,18.22 22.73,17.53 22.73,16.76 23.1,16.4 23.1,16.09 23.23,15.95 24.15,15.95 24.76,15.34 25.42,15.34 26.39,14.37 26.39,9.09 27.25,8.23 27.25,7.8 27.43,7.62 J4.6
B3  (via drill 0.25)
  Top 0.152: v9.4,27.3 11.3,25.4 18.16,25.4 21.59,21.97 U$1.O3
  Bottom 0.152: J5.8 12.7,48.26 12.7,46.31 10.11,43.71 10.06,43.71 9.53,43.18 9.53,31.04 9.63,30.93 9.63,30.53 9.4,30.3 v9.4,27.3
B4  (via drill 0.25)
  Top 0.152: v10.79,26.67 11.76,25.71 18.28,25.71 19.43,24.56 21.23,22.76 22.96,22.76 U$1.O4
  Bottom 0.152: J5.10 8.89,48.64 10.06,47.47 10.06,44.94 9.8,44.68 9.71,44.68 9.42,44.4 9.42,44.3 8.84,43.72 8.84,31.11 8.66,30.93 8.66,30.53 8.91,30.28 8.91,26.72 9.44,26.2 10.33,26.2 v10.79,26.67
B5
  Top 0.152: U$1.O5 26.67,22.61 26.72,22.61 27.18,23.06 32.36,23.06 33.93,21.49 33.93,9.52 33.98,9.47 33.98,8.2 J4.7
B6
  Top 0.152: J4.8 32.64,7.62 33.68,8.66 33.68,9.34 33.63,9.39 33.63,21.36 32.23,22.76 30.38,22.76 U$1.O6
CLOCK
  Top 0.152: U8.3 31.11,35.81 30.1,34.8 30.1,33.27 29.36,32.53 25.02,32.53 U4.24
COMP_OUT  (via drill 0.35)
  Top 0.152: IC2.1 33.4,28.83 34.74,28.83 R5.1 35.11,28.83 35.94,28.83 36.07,28.83 v36.58,29.34
  Bottom 0.152: Q3.2 37.4,47.43 36.96,46.99 36.96,29.72 v36.58,29.34
DATA
  Top 0.152: U4.23 24.95,31.47 27.27,31.47 27.29,31.5 31.24,31.5 31.82,32.08 33.11,32.08 33.24,31.95 34.11,31.95 34.48,32.32 34.48,33.59 33.53,34.54 U8.2
ENX
  Top 0.152: B2.A2 52.49,45.3 52.49,41.95 51.28,40.74 49.71,40.74 48.49,39.52 48.49,39.5 45.85,36.85 38.1,36.85 36.6,38.35 U8.5
ENY
  Top 0.152: B2.A0 50.09,41.2 49.74,41.2 48.18,39.65 48.18,39.62 45.72,37.16 38.23,37.16 36.4,38.99 31.75,38.99 31.62,39.12 31.62,39.15 31.52,39.25 31.52,40.23 31.5,40.26 32.13,40.89 U8.7
GND  (2 unrouted)
  pour Top: 0.13,55.88 1.4,57.15 10.16,57.15 12.7,59.69 48.26,59.69 50.8,57.15 53.34,57.15 53.34,2.54 50.8,0 2.67,0 0.13,2.54
IR_G
  Bottom 0.152: U$1.O15 13.97,47.88 12.8,49.05 12.8,50.7 J5.7
IR_H
  Bottom 0.152: J5.5 13.97,51.18 15.14,50.01 15.14,48.36 U$1.O14
IR_I
  Bottom 0.152: J5.3 16.51,51.18 17.68,50.01 17.68,48.36 U$1.O13
IR_J
  Bottom 0.152: J5.1 20.51,50.61 20.51,48.07 U$1.O12
LATCH  (via drill 0.35)
  Top 0.152: U4.25 25.3,35.56 v26.04,35.56 | v31.11,33.27 U8.1
  Bottom 0.152: v26.04,35.56 28.32,33.27 v31.11,33.27
MISO(RXDATA)  (via drill 0.25)
  Top 0.152: J9.1 7.39,15.6 7.82,15.6 8.56,14.86 v10.16,14.86 | U4.16 18.06,28.32 17.39,28.32 16.77,27.7 16.11,27.7 15.81,27.41 13.22,27.41 12.79,27.84 9.25,27.84 8.91,27.5 8.91,26.98 8.13,26.19 8.13,25.93 7.87,25.68 v7.87,23.5
  Bottom 0.152: v7.87,23.5 7.87,22.23 7.72,22.07 7.72,17.88 6.48,16.64 J9.1 | v10.16,14.86 10.79,14.86 13.84,11.81 13.84,9.78 14.99,8.64 J10.4
MOSI(SDIN)  (via drill 0.35)
  Top 0.152: v7.62,14.48 7.62,13.93 8.74,12.81 8.74,11.37 10.26,9.85 10.55,9.85 10.72,9.68 11.12,9.68 11.25,9.8 16.06,9.8 16.44,10.19 17.63,10.19 17.83,10.39 18.23,10.39 18.72,9.91 20.83,9.91 v20.95,9.78 | J9.4 7.52,20.55 7.52,23.17 7.39,23.3 7.39,23.7 7.52,23.82 7.52,25.75 7.82,26.06 7.82,26.32 8.61,27.1 8.61,27.63 9.12,28.14 12.92,28.14 13.35,27.71 15.69,27.71 15.98,28 16.61,28 U4.15
  Bottom 0.152: J10.7 20.07,5.97 21.23,7.14 21.23,8.1 20.95,8.38 v20.95,9.78 | J9.4 8.31,18.59 8.31,18.04 7.62,17.35 v7.62,14.48
N$1
  Bottom 0.152: R7.1 34.73,42.42 Q2.B
N$2
  Top 0.152: C4.1 12.25,13.97 Q1.2
  Bottom 0.152: 8.7,13.9 Q1.2 7.7,12.9 7.15,12.9 6.5,12.26 R1.2
N$3
  Bottom 0.152: Q2.C 40.7,43.69 R9.2
N$4  (2 unrouted)
N$5  (via drill 0.35)
  Top 0.152: R5.2 34.36,31.11 33.91,31.11 33.46,31.55 33.2,31.55 32.99,31.77 32.55,31.77 32.42,31.65 31.82,31.65 31.37,31.19 31.11,31.19 30.86,30.94 IC2.3 30.86,28.57 30.23,27.94 v26.8,27.94
  Bottom 0.152: R4.1 R3.2 | 25.59,28.13 R4.1 | v26.8,27.94 25.84,27.94 R4.1
N$6
  Bottom 0.152: R9.1 43.25,39.24 VR1.1
N$7
  Top 0.152: C3.1 13.52,37 Y1.1 13.52,36.11 U4.8
N$8  (via drill 0.35)
  Top 0.152: v32.77,31.24 32.77,30.41 IC2.2 | v34.8,35.24 35.69,35.24 R2.2 C5.1 38.74,36.01 v43.88,36.01
  Bottom 0.152: VR1.3 VR1.2 44.96,41.78 46.61,40.13 46.61,38.86 43.88,36.13 v43.88,36.01 | v32.77,31.24 32.26,31.75 32.26,34.92 32.57,35.24 v34.8,35.24
N$9  (1 unrouted)
N$10  (via drill 0.25)
  Top 0.152: LED2.A 28.96,10.16 v28.96,14.22 | R14.2 25.47,15.62 25.91,15.62 26.19,15.34 27.15,15.34 27.43,15.62 v27.94,15.62
  Bottom 0.152: v27.94,15.62 28.96,14.61 v28.96,14.22
N$14
  Top 0.152: R21.2 14.2,18.93 D2.A
N$16
  Top 0.152: C6.1 13.95,39.85 Y1.3 13.95,37.99 14.65,37.29 14.65,37.1 14.24,36.69 14.24,36.52 U4.7
PI_GROUND  (1 unrouted)
  Top 1.2: Q1.3 7.37,11.94 7.37,9.91 6.66,9.2 6.66,7.87 6.73,7.8 J3.2
PIPOWER_SIGNAL  (via drill 0.35)
  Top 0.152: U4.26 23.35,34.74 21.52,34.74 20.62,35.64 20.62,35.69 20.45,35.87 18.75,35.87 v18.41,36.2 | v13.6,28.9 13.44,28.75 8.87,28.75 7.52,27.4 7.52,26.19 5.97,24.64 5.97,24 4.45,22.48 v4.45,22.1
  Bottom 0.152: R1.1 4.83,14.67 4.83,20.83 4.45,21.21 v4.45,22.1 | v13.6,28.9 13.6,32.72 17.07,36.2 v18.41,36.2
RESET  (via drill 0.25)
  Top 0.152: J11.5 30.79,15.54 29.9,15.54 29.69,15.34 28.73,15.34 28.52,15.54 28.42,15.45 28.42,15.42 28.04,15.04 26.06,15.04 25.78,15.32 25.34,15.32 25.03,15.63 19.86,15.63 | J9.5 11.43,16.48 12.28,15.63 19.86,15.63 | 19.86,15.63 v19.68,15.8 | U4.29 21.66,36.45 21.59,36.45 20.95,37.08 v20.45,37.08
  Bottom 0.152: v19.68,15.8 19.18,16.31 19.18,16.84 19.1,16.92 19.1,18.16 18.87,18.39 18.87,19.94 17.88,20.93 17.88,22.07 18.48,22.67 R20.1 18.48,32.56 18.83,32.92 19.12,32.92 20.35,34.14 20.35,36.73 20.45,36.83 v20.45,37.08
RXI  (via drill 0.25)
  Top 0.152: v23.24,39.33 23.24,39.16 U4.30
  Bottom 0.152: v23.24,39.33 23.28,39.33 23.75,38.86 23.75,25.02 25.5,23.27 27.03,23.27 27.94,22.35 27.94,17.78 J11.1
SCK(SCIN)  (via drill 0.35)
  Top 0.152: v8.86,10.51 9.82,9.55 10.42,9.55 10.6,9.37 11.25,9.37 11.38,9.5 16.18,9.5 16.56,9.88 17.93,9.88 v18.03,9.78 | R21.1 15.2,18.16 13.08,18.16 12.83,17.91 v12.83,17.78 | U4.17 20.43,28.59 19.04,28.59 18.47,28.02 17.51,28.02 16.89,27.4 16.23,27.4 15.94,27.1 12.78,27.1 v12.57,27.3
  Bottom 0.152: v18.03,9.78 18.03,8.76 18.69,8.1 18.69,6.25 J10.5 | 10.03,15.34 9.96,15.34 9.6,14.98 9.6,13.62 9.11,13.13 8.86,13.13 8.64,12.91 8.64,10.73 v8.86,10.51 | 10.03,15.34 8.89,16.48 J9.3 8.89,17.52 10.06,18.69 10.06,23.39 11.68,25.02 11.68,26.42 v12.57,27.3 | 10.03,15.34 12.06,15.34 12.6,15.88 12.6,17.55 v12.83,17.78
SCL  (via drill 0.25)
  Top 0.152: v24.89,37.74 24.89,37.72 24.06,37.72 U4.28
  Bottom 0.152: v24.89,37.74 25.07,37.57 25.09,37.57 25.38,37.28 25.38,34.19 26.04,33.53 26.28,33.53 27.94,31.86 JP6.2 27.94,28.57
SCL_3V  (via drill 0.25, 0.35)
  Top 0.152: v9.21,24.57 10.16,23.62 10.16,15.75 10.59,15.32 24.05,15.32 24.89,14.48 Q5.1 | v9.89,8.62 10.52,8.62 10.67,8.76 11.5,8.76 11.63,8.89 22.16,8.89 v22.23,8.95
  Bottom 0.152: J4.1 23.24,5.97 22.07,7.14 22.07,8.1 22.76,8.79 | 22.76,8.79 23.45,8.79 R11.2 24.83,13.14 Q5.1 | U$1.I4 7.49,34.29 7.87,33.91 8,33.78 8,28.11 8.1,28.01 8.1,27.81 | J3.3 4.19,6.73 5.33,7.87 6.22,7.87 7.06,8.71 9.73,8.71 9.78,8.76 9.89,8.65 v9.89,8.62 | 22.76,8.79 22.39,8.79 v22.23,8.95 | v9.21,24.57 8.1,25.68 8.1,25.91 | 8.1,27.81 8.1,25.91 | 8.1,27.81 | 8.1,25.91
SCL_5V  (via drill 0.25)
  Top 0.152: LED2.C 29.97,11.34 Q5.3 30.35,12.83 v32.26,12.83
  Bottom 0.152: 28.19,27.3 JP6.1 28.19,27.05 28.19,24.56 28.83,23.93 31.5,23.93 33.76,21.67 33.76,14.33 v32.26,12.83 | R10.2 24.13,16.64 25.12,15.65 25.54,15.65 26.07,15.11 27.69,15.11 28.47,14.33 28.47,14.02 28.78,13.72 29.46,13.72 Q5.3
SDA  (via drill 0.35)
  Top 0.152: U4.27 22.75,35.27 v22.61,35.27
  Bottom 0.152: v22.61,35.27 22.61,29.2 22.58,29.18 22.58,28.74 22.61,28.71 JP5.2
SDA_3V  (via drill 0.25, 0.35)
  Top 0.152: J3.4 1.65,5.33 | 16.56,9.2 v16.76,9.4 | v16,20.07 15.14,20.93 15.14,22.07 14.45,22.76 14.4,22.76 13.46,23.7 11.56,23.7 10.77,24.49 10.44,24.49 v9.27,25.65 | 16.56,9.2 21.78,9.2 22.02,9.44 22.43,9.44 23.24,8.62 J4.2 | 16.56,9.2 11.5,9.2 11.37,9.07 10.47,9.07 10.29,9.24 v9.27,9.24
  Bottom 0.152: U$1.I5 7.37,36.83 8.38,35.81 8.38,31.09 8.36,31.06 8.36,28.19 8.41,28.14 8.41,26.52 v9.27,25.65 | J3.4 1.65,6.99 2.85,8.18 6.1,8.18 7.02,9.11 9.13,9.11 v9.27,9.24 | v16.76,9.4 16.76,10.41 17.78,11.43 Q4.1 17.4,13.59 17.4,14.36 17.42,14.38 17.42,14.82 17.4,14.85 R12.2 16.57,16.83 16,17.4 v16,20.07
SDA_5V
  Bottom 0.152: Q4.3 20.7,15.37 R6.2 20.73,16.86 20.7,16.89 19.56,16.89 19.41,17.04 19.41,18.29 19.18,18.52 19.18,20.07 19.53,20.42 20.22,21.11 20.22,22.76 20.73,23.27 21.07,23.27 21.12,23.22 21.56,23.22 21.7,23.37 JP5.1
SLEEPX
  Top 0.152: B2.A3 51.14,49.53 52.79,47.88 52.79,41.82 51.41,40.44 49.86,40.44 45.97,36.55 39.5,36.55 37.72,36.55 37.19,37.08 U8.4
SLEEPY
  Top 0.152: B2.A1 48.64,44.45 47.88,43.69 47.88,39.75 45.59,37.47 38.35,37.47 36.2,39.62 U8.6
SW_A
  Bottom 0.152: J6.3 26.67,50.8 U$1.O10
SW_B
  Bottom 0.152: U$1.O11 24.13,53.34 J6.4
SW_C
  Bottom 0.152: U$1.O8 31.75,50.16 J7.3
SW_D
  Bottom 0.152: U$1.O9 30.76,48.54 30.81,48.54 31.45,49.18 31.45,50.29 32.49,51.33 32.49,52.55 33.66,53.72 J7.4
SW_E
  Top 0.152: U6.3 41.26,51.42 J8.3
SW_E_BUF  (via drill 0.35)
  Top 0.152: U6.4 36.2,48.35 35.78,47.93 35.09,47.93 34.67,48.35 33.16,48.35 33.15,48.34 28.89,48.34 28.67,48.11 28.23,48.11 28,48.34 24.4,48.34 24.38,48.35 23.08,48.35 22.86,48.13 v22.86,48.01 | v21.34,41.02 U1.6 | U4.12 17.02,31.81 v17.02,33.22
  Bottom 0.152: v22.86,48.01 22.86,45.21 22.61,44.96 22.61,41.27 22.35,41.02 v21.34,41.02 21.11,40.8 21.06,40.8 20.35,40.08 20.35,37.67 19.96,37.28 19.96,34.19 19,33.22 v17.02,33.22
SW_EF_XOR  (via drill 0.35)
  Top 0.152: 11.18,31.55 U2.6 10.31,32.38 v10.29,32.38 | v19.18,34.42 19.05,34.29 16.64,34.29 16.13,33.78 13.34,33.78 v12.83,34.29 | U1.4 20.73,42.32 v20.07,41.66
  Bottom 0.152: v19.18,34.42 19.3,34.54 19.3,41.02 19.94,41.66 v20.07,41.66 | v10.29,32.38 10.29,33.53 11.05,34.29 v12.83,34.29
SW_F
  Top 0.152: J8.4 43.18,53.34 43.18,51.05 43.81,50.42 43.81,49.96 U5.3
SW_F_BUF  (via drill 0.35)
  Top 0.152: 24.89,41.02 25.02,41.15 v25.02,41.91 25.02,42.04 24.73,42.32 U1.3 | v37.72,50.29 34.67,50.29 33.02,48.64 v28.45,48.64 | U5.4 43.8,48.41 v43.21,48.99 | U4.13 18.73,32.38 v19.05,32.38 | U1.1 24.72,41.02 24.72,40.59 v24.51,40.39
  Bottom 0.152: v43.21,48.99 43.19,49.02 38.99,49.02 v37.72,50.29 | v19.05,32.38 19.08,32.38 20.65,33.96 20.65,36.6 20.93,36.88 20.93,37.28 20.65,37.56 20.65,39.93 21.11,40.39 21.59,40.39 v24.51,40.39 | v28.45,48.64 27.94,48.13 27.94,45.09 25.02,42.16 v25.02,41.91
SW_OR_ENCODER  (via drill 0.35)
  Top 0.152: U4.1 18.05,39.51 18.05,41.14 v17.91,41.27 | U2.4 v12.46,32.38
  Bottom 0.152: v17.91,41.27 16.13,39.5 16.13,37.85 13.53,35.24 13.53,34.08 12.46,33.02 v12.46,32.38
TXO  (via drill 0.25)
  Top 0.152: v22.23,39.81 22.23,39.28 U4.31
  Bottom 0.152: v22.23,39.81 23.44,39.81 24.05,39.2 24.05,25.14 25.63,23.57 27.15,23.57 27.74,22.99 29.84,22.99 30.58,22.25 30.58,17.88 J11.3
VCC_1  (15 unrouted)
  pour Bottom: 0,55.88 1.27,57.15 9.91,57.15 10.03,57.28 10.29,57.28 12.7,59.69 48.26,59.69 50.67,57.28 50.8,57.28 50.93,57.15 53.34,57.15 53.34,2.54 53.47,2.41 51.05,0 2.67,0 0,2.67
VCC_2  (via drill 0.25, 0.35)  (1 unrouted)
  Top 0.152: 18.8,4.06 v18.8,4.19 18.8,6.35 J10.6 | J5.11 6.35,53.09 7.37,54.1 19.94,54.1 20.83,53.21 20.83,50.42 | 20.83,50.42 20.83,50.04 20.32,49.53 J5.2 | J6.6 J6.5 27.94,50.93 27.43,50.42 20.83,50.42 | J7.5 J7.6 | J8.6 J8.5 46.61,52.07 v48.64,50.04 | v18.03,20.07 17.68,20.42 17.68,22.07 16.99,22.76 | 28.16,9.27 25.02,9.27 v22.86,11.43 20.83,11.43 20.32,11.94 Q4.2 | v32.89,9.02 32.64,9.27 28.19,9.27 | 28.19,9.27 28.18,9.26 | v27.43,10 28.16,9.27 | 28.16,9.27 28.19,9.27 | v35.43,26.92 29.84,26.92 26.67,23.75 v21.34,23.75 | v10.67,25.02 11.68,24 13.59,24 14.53,23.06 14.58,23.06 14.88,22.76 16.99,22.76 | 16.99,22.76 18.57,22.76 v19.05,23.24 | v48.53,37.21 48.53,31.13 48.51,31.11 v48.53,31.11
  Top 0.5: B2.3.3V 51.25,26.22
  Bottom 0.152: R11.1 22.86,10.16 v22.86,11.43 | Q4.2 20.32,13.84 18.8,15.37 18.8,18.03 18.1,18.73 R12.1 18.03,19.36 v18.03,20.07 | 11.28,5.61 11.28,4.6 12.57,3.3 19.68,3.3 | 19.68,3.3 26.8,3.3 | 26.8,3.3 31.62,3.3 32.89,4.57 v32.89,9.02 35.31,11.43 35.31,21.84 37.47,24 48.13,24 B2.3.3V | 19.68,3.3 v18.8,4.19 | 26.8,3.3 25.78,4.32 J4.3 | 27.43,12.32 Q5.2 v27.43,10 | v48.64,50.04 48.64,46.77 48.21,46.33 47.81,46.33 47.52,46.05 47.52,45.65 48.53,44.64 v48.53,37.21 | v48.53,31.11 48.53,30.48 | 48.53,30.48 48.53,28.94 B2.3.3V | J6.6 29.84,56.52 34.54,56.52 36.2,54.86 J7.6 38.1,56.52 42.67,56.52 44.45,54.74 J8.6 | 49.68,26.67 B2.3.3V | 48.53,30.48 40.39,30.48 36.83,26.92 v35.43,26.92 | v10.67,25.02 9.27,23.62 8.89,23.62 6.35,26.16 U$1.I1 | v19.05,23.24 19.56,23.75 v21.34,23.75
WAKE_LED
  Top 0.152: J10.1 13.84,3.68 28.83,3.68 29.69,4.54 29.69,8.48 30.1,8.89 32.34,8.89 32.69,8.53 33.09,8.53 33.38,8.82 33.38,9.22 33.33,9.27 33.33,21.21 32.95,21.59 U$1.O7
WAKE_SW  (via drill 0.35)
  Top 0.152: v16.2,11.49 16.2,12.22 U7.3
  Bottom 0.152: J10.3 16.15,6.25 16.15,8.1 15.75,8.51 15.75,10.54 16.2,10.99 v16.2,11.49
WAKE_SW_BUF  (via drill 0.35)
  Top 0.152: v15.11,29.34 15.03,29.42 | v15.11,29.34 14.52,29.93 U2.3 | U7.4 16.61,14.61 v16.89,14.61 | U4.14 16.81,29.34 v15.11,29.34 | v17.53,26.54 19.43,26.54 21.39,24.59 25.53,24.59 25.7,24.77 25.91,24.77 26.77,25.63 27.4,25.63 27.71,25.95 27.71,26.79 28.23,27.3 v29.03,27.3
  Bottom 0.152: v16.89,14.61 16.38,15.11 16.38,15.49 15.34,16.54 15.34,26.54 | v29.03,27.3 29.59,27.3 JP3.1 | v15.11,29.34 15.34,29.11 15.34,26.54 | v17.53,26.54 15.34,26.54
XDIR  (via drill 0.35)
  Top 0.152: v4.19,34.54 4.19,34.04 5.31,32.92 9.98,32.92 9.99,32.92 12.68,32.92 13.15,32.45 13.22,32.45 14.43,31.24 15.32,31.24 U4.11
  Bottom 0.152: B2.D3 4.27,45.26 4.27,37 4.17,36.9 4.17,34.57 v4.19,34.54
XMS1
  Top 0.152: B2.D4 3.45,43.54 3.73,43.54 4.32,44.12 5.84,44.12 5.87,44.09 6.66,44.09 6.73,44.02 9.4,44.02 9.71,43.71 24.92,43.71 26.21,42.42 26.21,38.48 27.1,37.59 29.3,37.59 29.59,37.31 29.59,35.94 29.46,35.81 U8.14
XMS2  (1 unrouted)
  Top 0.152: B2.D5 4.45,43.81 5.68,43.81 5.7,43.79 6.53,43.79 6.61,43.71 9.28,43.71 9.58,43.41 24.79,43.41 25.91,42.29 25.91,38.35 27.18,37.08 U8.13 | 9.68,43.31 9.54,43.45
XSTEP  (via drill 0.25)
  Top 0.152: U4.10 14.7,31.75 14.35,31.75 12.88,33.22 10.11,33.22 v7.87,35.46
  Bottom 0.152: B2.D2 4.57,47.5 4.57,36.88 4.47,36.78 4.47,36.38 5.18,35.66 7.67,35.66 v7.87,35.46
YDIR
  Top 0.152: B2.D7 3.71,38 7.24,38 7.86,37.38 7.86,37.16 8.84,36.18 9.06,36.18 10.1,35.14 10.1,35.12 11.69,33.52 13.16,33.52 13.21,33.48 14.05,33.48 U4.9
YMS1  (via drill 0.25, 0.35)
  Top 0.152: v4.95,36.58 2.54,34.16 B2.D8 | 6.78,44.4 v6.48,44.7 6.86,44.32 9.35,44.32 9.71,44.68 10.11,44.68 10.46,44.32 28.45,44.32 29.59,43.18 29.59,38.61 29.34,38.35 U8.12
  Bottom 0.152: v4.95,36.58 5.18,36.8 5.18,43.41 v6.48,44.7
YMS2  (via drill 0.25)
  Top 0.152: v9.14,30.73 8.89,30.48 B2.D9 | U8.11 27.03,39.62 26.52,40.13 26.52,42.55 25.04,44.02 10.08,44.02 v9.91,44.2
  Bottom 0.152: v9.91,44.2 9.14,43.43 v9.14,30.73
YSTEP
  Top 0.152: B2.D6 3.94,39.37 4.7,40.13 4.7,41.91 5.87,43.08 5.97,43.18 6.28,43.18 6.35,43.1 9.02,43.1 9.43,42.7 15.72,42.7 16.76,41.66 16.76,41.02 17.67,40.12 17.67,38.75 U4.2

### Text on the board
tNames: IR Sensor Board | SX1509 Breakout | - | B | + | - | D | + | - | F | + | - | A | + | - | C | + | - | E | + | + | - | G | H | I | J | 0 | 5V | A0 | A1 | A2 | - | + | 5 | 1 | 4 | 2 | 3 | 3 | 2 | 4 | 1 | 5 | 0 | 6 | 7 | VIN | GND | 8 | GND | 9 | +5V | Rst hold time | 10 | +3.3V | 11 | RST | 12 | 13 | GND | AREF | SDA | SCL | - | 5V | - | Rx | 3.3V | B0 | SDA | - | B2 | B4 | SCL | 3.3V | B1 | B3 | LED | SW | CIN | DIN | Raspberry
bNames: Polar / Controller | Short JP3 to enable / hard reset by switch. | UR1 adjusts the / hold time for reset | Short JP2 to disable / control of Pi Power / from Arduino | Version 1.0.8 / By Keir Rice
tValues: Valid combinations: | 168V / 3.3V Reg / 8MHz | 168 / 5V Reg / 16MHz | 168 / 5V Reg / 20MHz | Mark back accordingly | Arduino Pro Mini